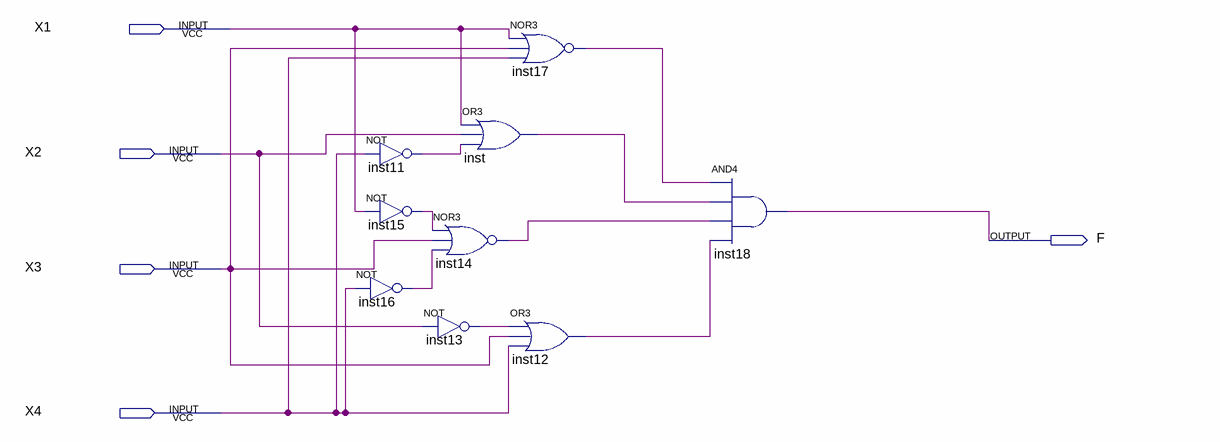
[diagram p0: schematic sheet]
// Quartus schematic Lab2.bdf as structural Verilog: 9 symbols, 5 pins
module Lab2 (
  input  X1,
  input  X2,
  input  X3,
  input  X4,
  output F
);

  wire inst11_out, inst12_out, inst13_out, inst14_out, inst15_out, inst16_out, inst17_out, inst_out;

  not inst11 (inst11_out, X4);
  not inst15 (inst15_out, X1);
  not inst16 (inst16_out, X4);
  or inst (inst_out, X1, X2, inst11_out);
  nor inst14 (inst14_out, inst15_out, X3, inst16_out);
  not inst13 (inst13_out, X2);
  nor inst17 (inst17_out, X1, X3, X4);
  or inst12 (inst12_out, inst13_out, X3, X4);
  and inst18 (F, inst17_out, inst_out, inst14_out, inst12_out);
endmodule
